# Altium schematic sheet LED_backlight.SchDoc
size A4
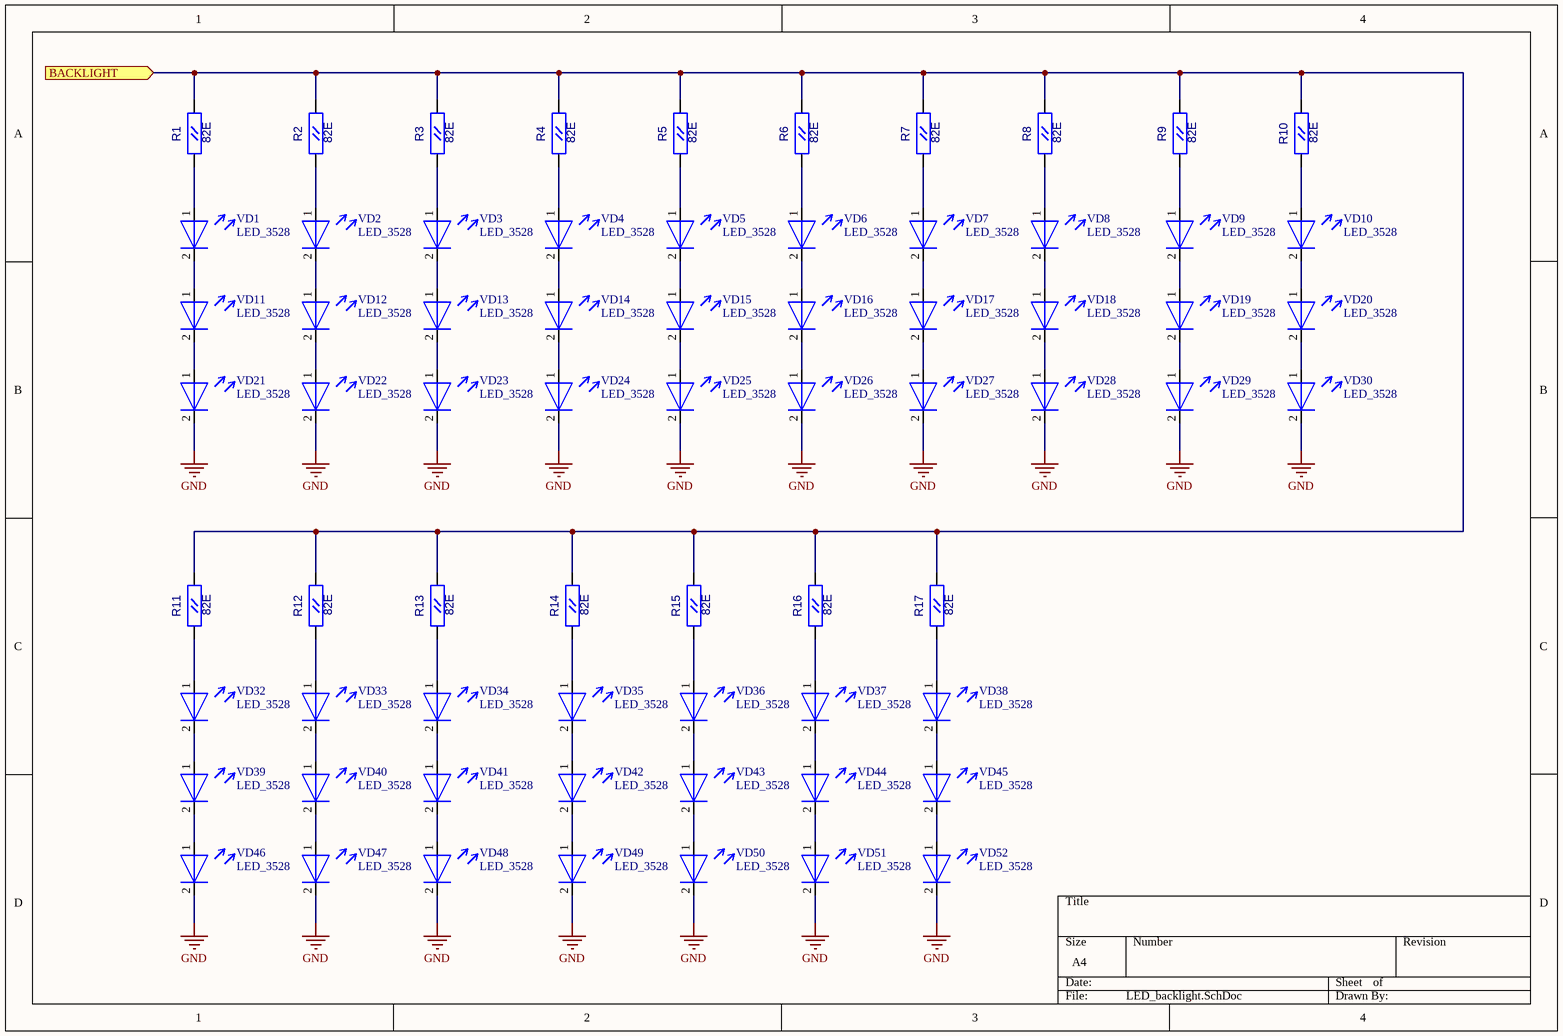
[diagram p0: LED_backlight.SchDoc]

## Parts
R1  82E  [RC0805]
R2  82E  [RC0805]
R3  82E  [RC0805]
R4  82E  [RC0805]
R5  82E  [RC0805]
R6  82E  [RC0805]
R7  82E  [RC0805]
R8  82E  [RC0805]
R9  82E  [RC0805]
R10  82E  [RC0805]
R11  82E  [RC0805]
R12  82E  [RC0805]
R13  82E  [RC0805]
R14  82E  [RC0805]
R15  82E  [RC0805]
R16  82E  [RC0805]
R17  82E  [RC0805]
VD1  LED_3528  [3528LED]
VD2  LED_3528  [3528LED]
VD3  LED_3528  [3528LED]
VD4  LED_3528  [3528LED]
VD5  LED_3528  [3528LED]
VD6  LED_3528  [3528LED]
VD7  LED_3528  [3528LED]
VD8  LED_3528  [3528LED]
VD9  LED_3528  [3528LED]
VD10  LED_3528  [3528LED]
VD11  LED_3528  [3528LED]
VD12  LED_3528  [3528LED]
VD13  LED_3528  [3528LED]
VD14  LED_3528  [3528LED]
VD15  LED_3528  [3528LED]
VD16  LED_3528  [3528LED]
VD17  LED_3528  [3528LED]
VD18  LED_3528  [3528LED]
VD19  LED_3528  [3528LED]
VD20  LED_3528  [3528LED]
VD21  LED_3528  [3528LED]
VD22  LED_3528  [3528LED]
VD23  LED_3528  [3528LED]
VD24  LED_3528  [3528LED]
VD25  LED_3528  [3528LED]
VD26  LED_3528  [3528LED]
VD27  LED_3528  [3528LED]
VD28  LED_3528  [3528LED]
VD29  LED_3528  [3528LED]
VD30  LED_3528  [3528LED]
VD32  LED_3528  [3528LED]
VD33  LED_3528  [3528LED]
VD34  LED_3528  [3528LED]
VD35  LED_3528  [3528LED]
VD36  LED_3528  [3528LED]
VD37  LED_3528  [3528LED]
VD38  LED_3528  [3528LED]
VD39  LED_3528  [3528LED]
VD40  LED_3528  [3528LED]
VD41  LED_3528  [3528LED]
VD42  LED_3528  [3528LED]
VD43  LED_3528  [3528LED]
VD44  LED_3528  [3528LED]
VD45  LED_3528  [3528LED]
VD46  LED_3528  [3528LED]
VD47  LED_3528  [3528LED]
VD48  LED_3528  [3528LED]
VD49  LED_3528  [3528LED]
VD50  LED_3528  [3528LED]
VD51  LED_3528  [3528LED]
VD52  LED_3528  [3528LED]

## Ports
BACKLIGHT (in)

## Nets
GND: VD21.2(K) VD22.2(K) VD23.2(K) VD24.2(K) VD25.2(K) VD26.2(K) VD27.2(K) VD28.2(K) VD29.2(K) VD30.2(K) VD46.2(K) VD47.2(K) VD48.2(K) VD49.2(K) VD50.2(K) VD51.2(K) VD52.2(K)
BACKLIGHT: R1.2(B) R2.2(B) R3.2(B) R4.2(B) R5.2(B) R6.2(B) R7.2(B) R8.2(B) R9.2(B) R10.2(B) R11.2(B) R12.2(B) R13.2(B) R14.2(B) R15.2(B) R16.2(B) R17.2(B) ; port BACKLIGHT
NetR1_1: R1.1(A) VD1.1(A)
NetR2_1: R2.1(A) VD2.1(A)
NetR3_1: R3.1(A) VD3.1(A)
NetR4_1: R4.1(A) VD4.1(A)
NetR5_1: R5.1(A) VD5.1(A)
NetR6_1: R6.1(A) VD6.1(A)
NetR7_1: R7.1(A) VD7.1(A)
NetR8_1: R8.1(A) VD8.1(A)
NetR9_1: R9.1(A) VD9.1(A)
NetR10_1: R10.1(A) VD10.1(A)
NetR11_1: R11.1(A) VD32.1(A)
NetR12_1: R12.1(A) VD33.1(A)
NetR13_1: R13.1(A) VD34.1(A)
NetR14_1: R14.1(A) VD35.1(A)
NetR15_1: R15.1(A) VD36.1(A)
NetR16_1: R16.1(A) VD37.1(A)
NetR17_1: R17.1(A) VD38.1(A)
NetVD1_2: VD1.2(K) VD11.1(A)
NetVD2_2: VD2.2(K) VD12.1(A)
NetVD3_2: VD3.2(K) VD13.1(A)
NetVD4_2: VD4.2(K) VD14.1(A)
NetVD5_2: VD5.2(K) VD15.1(A)
NetVD6_2: VD6.2(K) VD16.1(A)
NetVD7_2: VD7.2(K) VD17.1(A)
NetVD8_2: VD8.2(K) VD18.1(A)
NetVD9_2: VD9.2(K) VD19.1(A)
NetVD10_2: VD10.2(K) VD20.1(A)
NetVD11_2: VD11.2(K) VD21.1(A)
NetVD12_2: VD12.2(K) VD22.1(A)
NetVD13_2: VD13.2(K) VD23.1(A)
NetVD14_2: VD14.2(K) VD24.1(A)
NetVD15_2: VD15.2(K) VD25.1(A)
NetVD16_2: VD16.2(K) VD26.1(A)
NetVD17_2: VD17.2(K) VD27.1(A)
NetVD18_2: VD18.2(K) VD28.1(A)
NetVD19_2: VD19.2(K) VD29.1(A)
NetVD20_2: VD20.2(K) VD30.1(A)
NetVD32_2: VD32.2(K) VD39.1(A)
NetVD33_2: VD33.2(K) VD40.1(A)
NetVD34_2: VD34.2(K) VD41.1(A)
NetVD35_2: VD35.2(K) VD42.1(A)
NetVD36_2: VD36.2(K) VD43.1(A)
NetVD37_2: VD37.2(K) VD44.1(A)
NetVD38_2: VD38.2(K) VD45.1(A)
NetVD39_2: VD39.2(K) VD46.1(A)
NetVD40_2: VD40.2(K) VD47.1(A)
NetVD41_2: VD41.2(K) VD48.1(A)
NetVD42_2: VD42.2(K) VD49.1(A)
NetVD43_2: VD43.2(K) VD50.1(A)
NetVD44_2: VD44.2(K) VD51.1(A)
NetVD45_2: VD45.2(K) VD52.1(A)

## Library data of the parts
R1-R17 = RC0805: Value: 82E
VD1-VD30 VD32-VD52 = 3528LED: Value: LED_3528